# Altium project 2418driver.PrjPcb
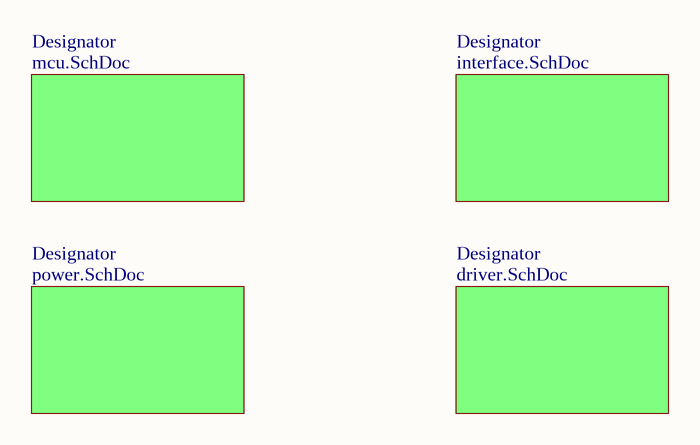
[diagram p0: 2418driver.SchDoc]
5 sheets, 136 parts. Net scope: global (net labels, ports and power ports of the same name join across sheets).
Board file: 2418driver.PcbDoc
Sheets:
  2418driver.SchDoc
    Designator = mcu.SchDoc
    Designator = interface.SchDoc
    Designator = power.SchDoc
    Designator = driver.SchDoc

## Sheet 2418driver.SchDoc
size A4

### Sub-sheets
Designator = mcu.SchDoc: no entries
Designator = interface.SchDoc: no entries
Designator = power.SchDoc: no entries
Designator = driver.SchDoc: no entries

## Sheet mcu.SchDoc
size A4
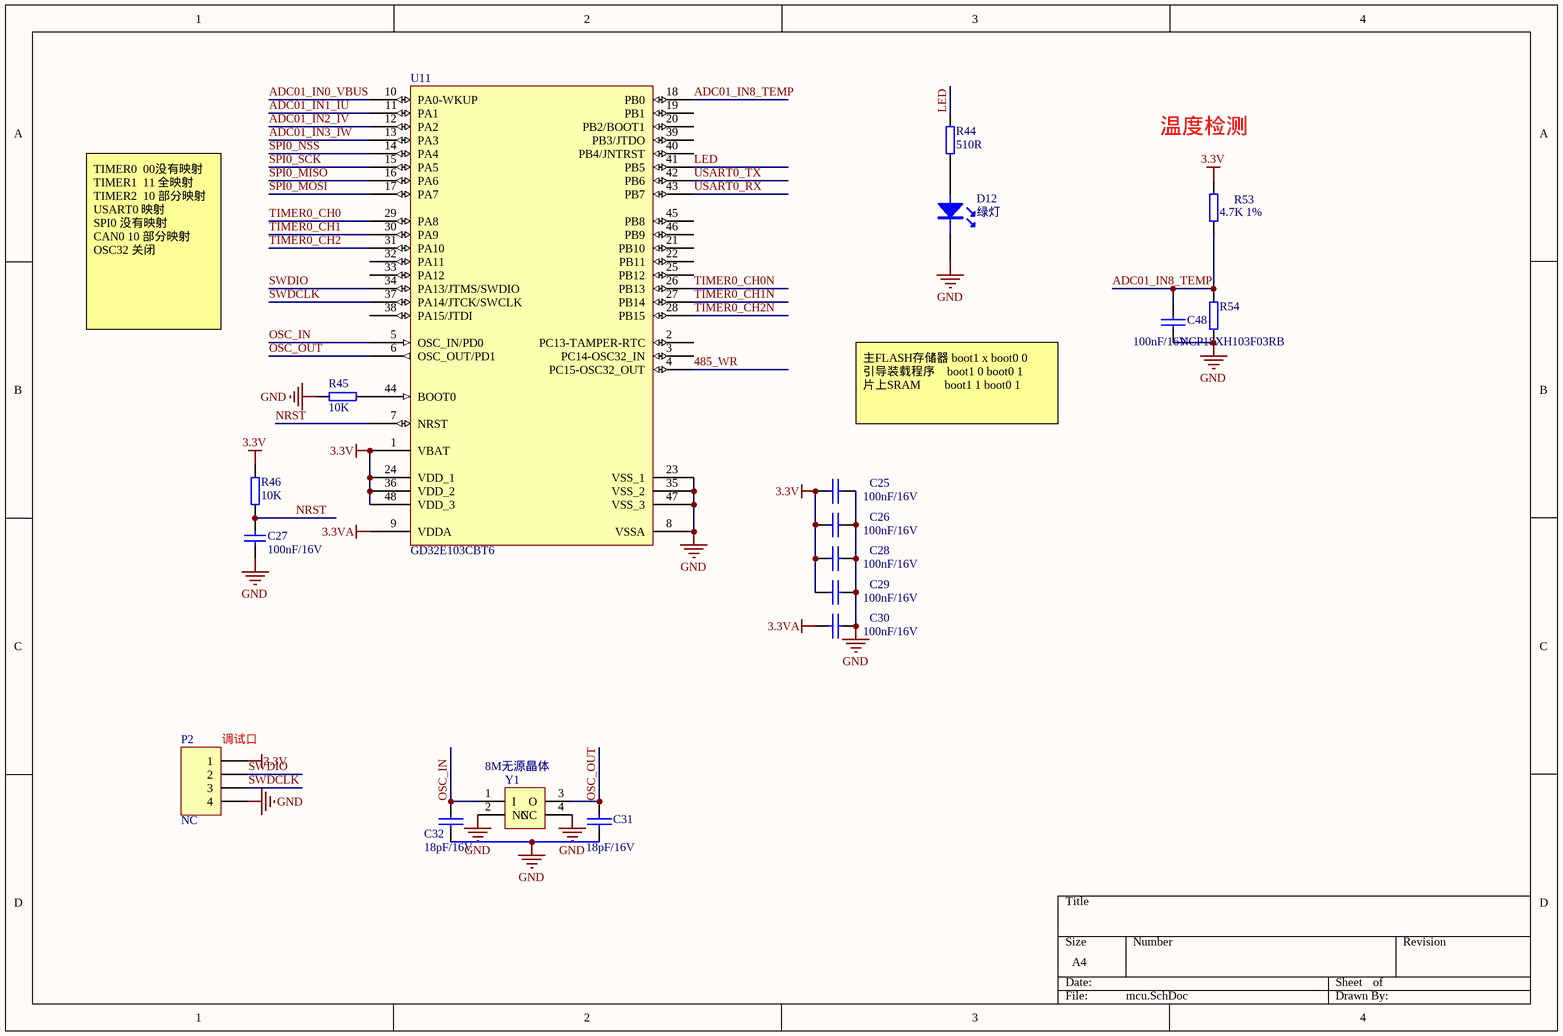
[diagram p1: mcu.SchDoc]

### Parts
C25  100nF/16V  [C0402]
C26  100nF/16V  [C0402]
C27  100nF/16V  [C0402]
C28  100nF/16V  [C0402]
C29  100nF/16V  [C0402]
C30  100nF/16V  [C0402]
C31  18pF/16V  [C0402]
C32  18pF/16V  [C0402]
C48  100nF/16V  [C0402]
D12  绿灯  [LED_0603]
P2  NC  [2.0*4]
R44  510R  [R0402]
R45  10K  [R0402]
R46  10K  [R0402]
R53  4.7K 1%  [R0402]
R54  NCP18XH103F03RB  [R0603]
U11  GD32E103CBT6  [LQFP-48]
Y1  8M无源晶体  [5032 4pin]

### Nets
3.3V: C25.2 C26.2 C28.2 C29.2 P2.1 R46.2 R53.2 U11.1(VBAT) U11.24(VDD_1) U11.36(VDD_2) U11.48(VDD_3)
3.3VA: C30.2 U11.9(VDDA)
GND: C25.1 C26.1 C27.1 C28.1 C29.1 C30.1 C31.1 C32.1 C48.2 D12.2(K) P2.4 R45.1 R54.1 U11.8(VSSA) U11.23(VSS_1) U11.35(VSS_2) U11.47(VSS_3) Y1.2(NC) Y1.4(NC)
485_WR: U11.4(PC15-OSC32_OUT)
ADC01_IN0_VBUS: U11.10(PA0-WKUP)
ADC01_IN1_IU: U11.11(PA1)
ADC01_IN2_IV: U11.12(PA2)
ADC01_IN3_IW: U11.13(PA3)
ADC01_IN8_TEMP: C48.1 R53.1 R54.2 U11.18(PB0)
LED: R44.1 U11.41(PB5)
NRST: C27.2 R46.1 U11.7(NRST)
OSC_IN: C32.2 U11.5(OSC_IN/PD0) Y1.1(I)
OSC_OUT: C31.2 U11.6(OSC_OUT/PD1) Y1.3(O)
SPI0_MISO: U11.16(PA6)
SPI0_MOSI: U11.17(PA7)
SPI0_NSS: U11.14(PA4)
SPI0_SCK: U11.15(PA5)
SWDCLK: P2.3 U11.37(PA14/JTCK/SWCLK)
SWDIO: P2.2 U11.34(PA13/JTMS/SWDIO)
TIMER0_CH0: U11.29(PA8)
TIMER0_CH0N: U11.26(PB13)
TIMER0_CH1: U11.30(PA9)
TIMER0_CH1N: U11.27(PB14)
TIMER0_CH2: U11.31(PA10)
TIMER0_CH2N: U11.28(PB15)
USART0_RX: U11.43(PB7)
USART0_TX: U11.42(PB6)
NetD12_1: D12.1(A) R44.2
NetR45_2: R45.2 U11.44(BOOT0)

Not connected (* = marked no-connect by the designer): U11 2(PC13-TAMPER-RTC) 3(PC14-OSC32_IN) 19(PB1) 20(PB2/BOOT1) 21(PB10) 22(PB11) 25(PB12) 32(PA11) 33(PA12) 38(PA15/JTDI) 39(PB3/JTDO) 40(PB4/JNTRST) 45(PB8) 46(PB9)

### Notes on the sheet
- 温度检测
- TIMER0  00没有映射
  TIMER1  11 全映射
  TIMER2  10 部分映射
  USART0 映射
  SPI0 没有映射
  CAN0 10 部分映射
  OSC32 关闭
- 主FLASH存储器 boot1 x boot0 0
  引导装载程序    boot1 0 boot0 1
  片上SRAM        boot1 1 boot0 1
- (near P2) 调试口

### Library data of the parts
C25 C26 C28-C32 C48 = CAP: Capacitor
C27 = cap
D12 = LED: 绿灯led
P2 = 排针2mm,1*4: 空，无器件; LatestRevisionDate: 17-Jul-2002; LatestRevisionNote: Re-released for DXP Platform.; Publisher: Altium Limited
R44 R53 R54 = R
R45 R46 = Resistance
U11 = GD32E103CxT6: Published: *; DatasheetVersion: *; PackageVersion: *; PackageReference: *; Publisher: *; PackageDescription: *; ComponentLink1Description: *; ComponentLink1URL: *; ComponentLink2Description: *; ComponentLink2URL: *
Y1 = OSC24

## Sheet interface.SchDoc
size A4
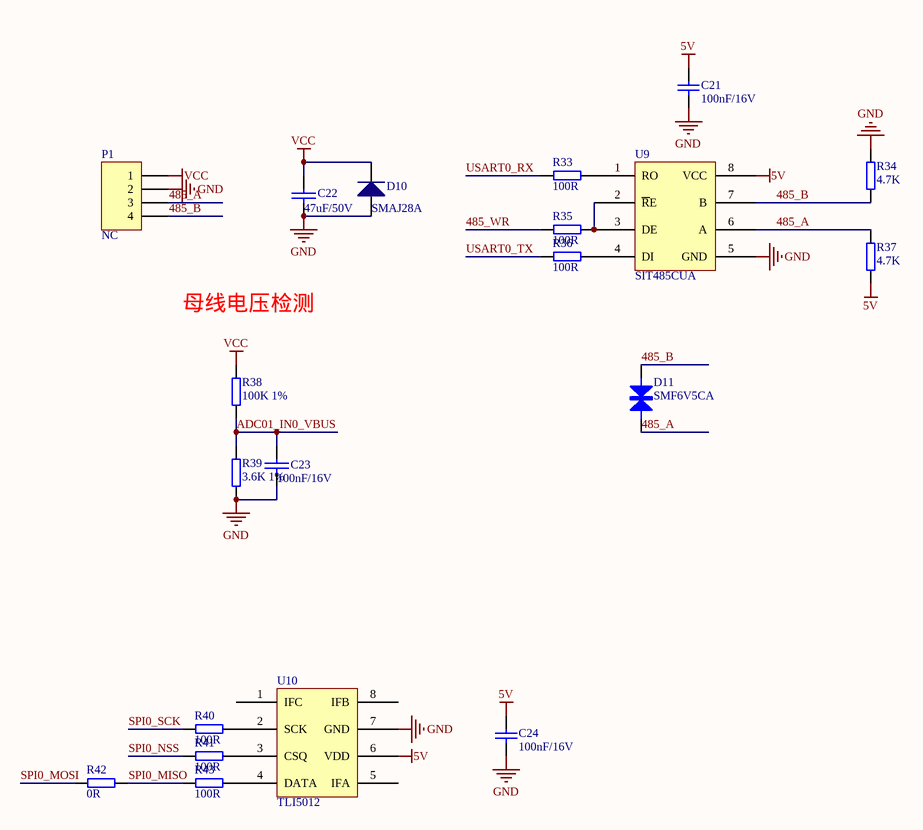
[diagram p2: interface.SchDoc]

### Parts
C21  100nF/16V  [C0402]
C22  47uF/50V  [C1210_N]
C23  100nF/16V  [C0402]
C24  100nF/16V  [C0402]
D10  SMAJ28A  [DO-214AC SMA]
D11  SMF6V5CA  [SOD-123]
P1  NC  [2.54-4]
R33  100R  [R0402]
R34  4.7K  [R0402]
R35  100R  [R0402]
R36  100R  [R0402]
R37  4.7K  [R0402]
R38  100K 1%  [R0402]
R39  3.6K 1%  [R0402]
R40  100R  [R0402]
R41  100R  [R0402]
R42  0R  [R0402]
R43  100R  [R0402]
U9  SIT485CUA  [VSSOP/MSOP-8]
U10  TLI5012  [SOIC-8]

### Nets
5V: C21.1 C24.1 R37.1 U9.8(VCC) U10.6(VDD)
GND: C21.2 C22.2 C23.2 C24.2 D10.1 P1.2 R34.2 R39.1 U9.5(GND) U10.7(GND)
VCC: C22.1 D10.2 P1.1 R38.2
485_A: D11.2(Anode) P1.3 R37.2 U9.6(A)
485_B: D11.1(Anode) P1.4 R34.1 U9.7(B)
485_WR: R35.2
ADC01_IN0_VBUS: C23.1 R38.1 R39.2
SPI0_MISO: R42.1 R43.2
SPI0_MOSI: R42.2
SPI0_NSS: R41.2
SPI0_SCK: R40.2
USART0_RX: R33.2
USART0_TX: R36.2
NetR33_1: R33.1 U9.1(RO)
NetR35_1: R35.1 U9.2(~{R}E) U9.3(DE)
NetR36_1: R36.1 U9.4(DI)
NetR40_1: R40.1 U10.2(SCK)
NetR41_1: R41.1 U10.3(CSQ)
NetR43_1: R43.1 U10.4(DATA)

Not connected (* = marked no-connect by the designer): U10 1(IFC) 5(IFA) 8(IFB)

### Notes on the sheet
- 母线电压检测

### Library data of the parts
C21 C24 = cap
C22 C23 = CAP: Capacitor
D10 = Diode
D11 = Bi-DIODES
P1 = Header 4: LatestRevisionDate: 17-Jul-2002; LatestRevisionNote: Re-released for DXP Platform.; Publisher: Altium Limited
R33-R43 = Resistance
U9 = SP485
U10 = TLE5012

## Sheet power.SchDoc
size A4
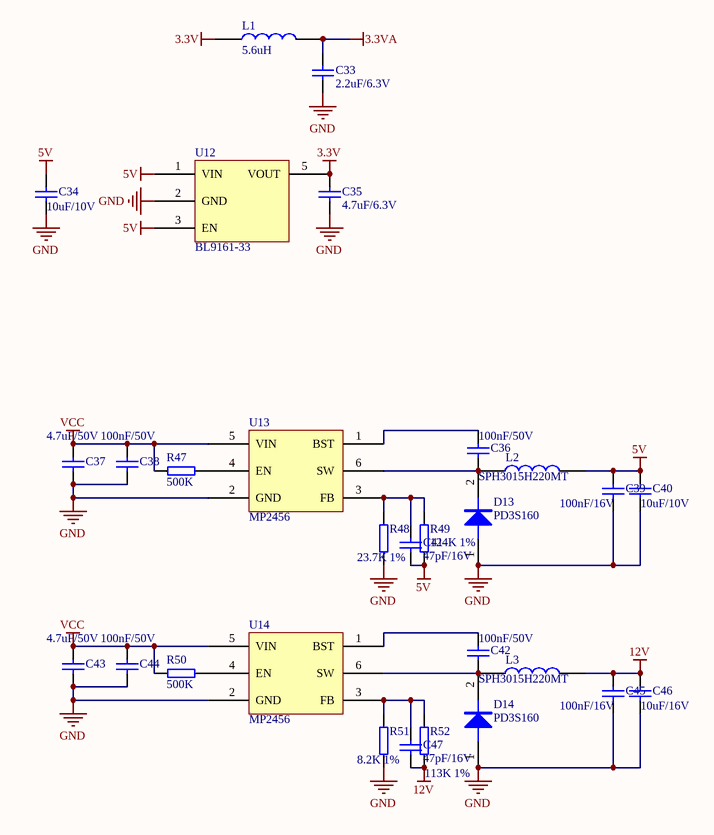
[diagram p3: power.SchDoc]

### Parts
C33  2.2uF/6.3V  [C0402]
C34  10uF/10V  [C0603]
C35  4.7uF/6.3V  [C0603]
C36  100nF/50V  [C0402]
C37  4.7uF/50V  [C0603]
C38  100nF/50V  [C0402]
C39  100nF/16V  [C0402]
C40  10uF/10V  [C0603]
C41  47pF/16V  [C0402]
C42  100nF/50V  [C0402]
C43  4.7uF/50V  [C0603]
C44  100nF/50V  [C0402]
C45  100nF/16V  [C0402]
C46  10uF/16V  [C0805]
C47  47pF/16V  [C0402]
D13  PD3S160  [POWERDI323]
D14  PD3S160  [POWERDI323]
L1  5.6uH  [L0402]
L2  SPH3015H220MT  [SPH3015]
L3  SPH3015H220MT  [SPH3015]
R47  500K  [R0402]
R48  23.7K 1%  [R0402]
R49  124K 1%  [R0402]
R50  500K  [R0402]
R51  8.2K 1%  [R0402]
R52  113K 1%  [R0402]
U12  BL9161-33  [SOT-23(5)]
U13  MP2456  [SOT-23(6)]
U14  MP2456  [SOT-23(6)]

### Nets
3.3V: C35.2 L1.1 U12.5(VOUT)
3.3VA: C33.2 L1.2
5V: C34.2 C39.2 C40.2 C41.2 L2.2 R49.1 U12.1(VIN) U12.3(EN)
12V: C45.2 C46.2 C47.2 L3.2 R52.1
GND: C33.1 C34.1 C35.1 C37.1 C38.1 C39.1 C40.1 C43.1 C44.1 C45.1 C46.1 D13.1(A) D14.1(A) R48.1 R51.1 U12.2(GND) U13.2(GND) U14.2(GND)
VCC: C37.2 C38.2 C43.2 C44.2 R47.1 R50.1 U13.5(VIN) U14.5(VIN)
NetC36_1: C36.1 U13.1(BST)
NetC36_2: C36.2 D13.2(K) L2.1 U13.6(SW)
NetC41_1: C41.1 R48.2 R49.2 U13.3(FB)
NetC42_1: C42.1 U14.1(BST)
NetC42_2: C42.2 D14.2(K) L3.1 U14.6(SW)
NetC47_1: C47.1 R51.2 R52.2 U14.3(FB)
NetR47_2: R47.2 U13.4(EN)
NetR50_2: R50.2 U14.4(EN)

### Library data of the parts
C33-C47 = cap
D13 D14 = DIODE
L1 = INDUCTOR: 贴片电感
L2 L3 = INDUCTOR: 顺络 22uH
R47-R52 = Resistance
U12 = BL9161

## Sheet driver.SchDoc
size A4
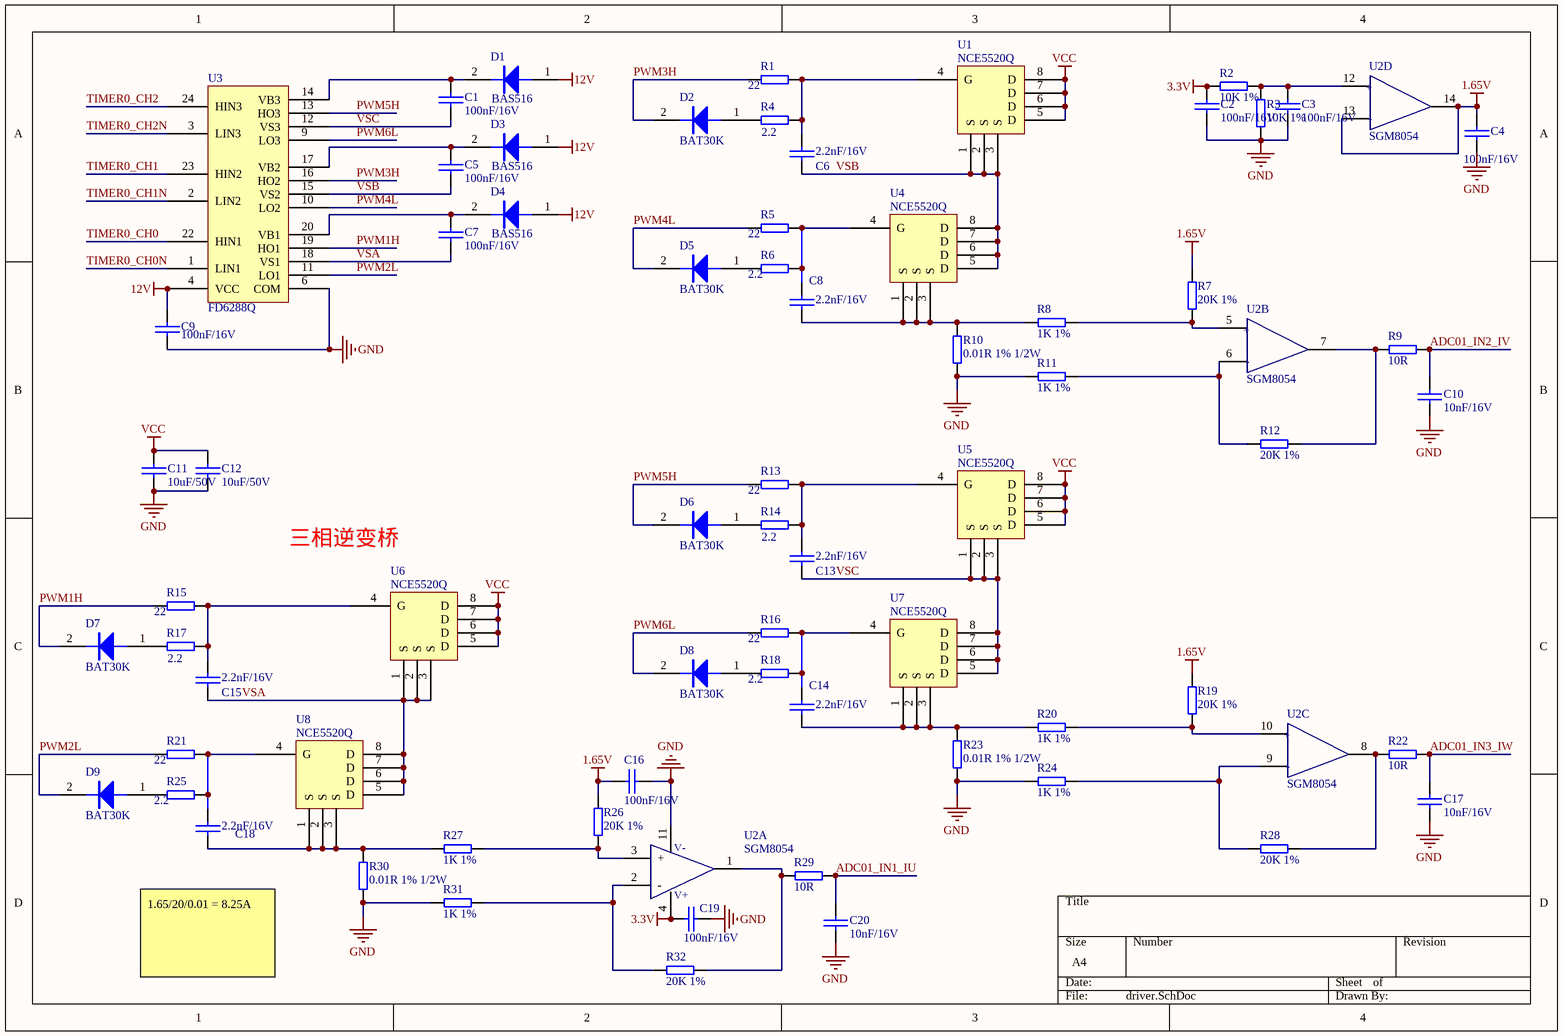
[diagram p4: driver.SchDoc]

### Parts
C1  100nF/16V  [C0402]
C2  100nF/16V  [C0402]
C3  100nF/16V  [C0402]
C4  100nF/16V  [C0402]
C5  100nF/16V  [C0402]
C6  2.2nF/16V  [C0402]
C7  100nF/16V  [C0402]
C8  2.2nF/16V  [C0402]
C9  100nF/16V  [C0402]
C10  10nF/16V  [C0402]
C11  10uF/50V  [C1206]
C12  10uF/50V  [C1206]
C13  2.2nF/16V  [C0402]
C14  2.2nF/16V  [C0402]
C15  2.2nF/16V  [C0402]
C16  100nF/16V  [C0402]
C17  10nF/16V  [C0402]
C18  2.2nF/16V  [C0402]
C19  100nF/16V  [C0402]
C20  10nF/16V  [C0402]
D1  BAS516  [SOD-523/SC-79]
D2  BAT30K  [SOD-523/SC-79]
D3  BAS516  [SOD-523/SC-79]
D4  BAS516  [SOD-523/SC-79]
D5  BAT30K  [SOD-523/SC-79]
D6  BAT30K  [SOD-523/SC-79]
D7  BAT30K  [SOD-523/SC-79]
D8  BAT30K  [SOD-523/SC-79]
D9  BAT30K  [SOD-523/SC-79]
R1  22  [R0402]
R2  10K 1%  [R0402]
R3  10K 1%  [R0402]
R4  2.2  [R0402]
R5  22  [R0402]
R6  2.2  [R0402]
R7  20K 1%  [R0402]
R8  1K 1%  [R0402]
R9  10R  [R0402]
R10  0.01R 1% 1/2W  [R0805]
R11  1K 1%  [R0402]
R12  20K 1%  [R0402]
R13  22  [R0402]
R14  2.2  [R0402]
R15  22  [R0402]
R16  22  [R0402]
R17  2.2  [R0402]
R18  2.2  [R0402]
R19  20K 1%  [R0402]
R20  1K 1%  [R0402]
R21  22  [R0402]
R22  10R  [R0402]
R23  0.01R 1% 1/2W  [R0805]
R24  1K 1%  [R0402]
R25  2.2  [R0402]
R26  20K 1%  [R0402]
R27  1K 1%  [R0402]
R28  20K 1%  [R0402]
R29  10R  [R0402]
R30  0.01R 1% 1/2W  [R0805]
R31  1K 1%  [R0402]
R32  20K 1%  [R0402]
U1  NCE5520Q  [DFN3X3-8L]
U2  SGM8054  [TSSOP-14]  (parts A,B,C,D of 4)
U3  FD6288Q  [QFN_P0.5_24]
U4  NCE5520Q  [DFN3X3-8L]
U5  NCE5520Q  [DFN3X3-8L]
U6  NCE5520Q  [DFN3X3-8L]
U7  NCE5520Q  [DFN3X3-8L]
U8  NCE5520Q  [DFN3X3-8L]

### Nets
1.65V: C4.1 C16.2 R7.1 R19.1 R26.1 U2.13(-) U2.14(OUT2)
3.3V: C2.1 C19.2 R2.1 U2.4(V+)
12V: C9.2 D1.1(A) D3.1(A) D4.1(A) U3.4(VCC)
GND: C2.2 C3.2 C4.2 C9.1 C10.2 C11.2 C12.2 C16.1 C17.2 C19.1 C20.2 R3.2 R10.2 R11.2 R23.2 R24.2 R30.2 R31.2 U2.11(V-) U3.6(COM)
VCC: C11.1 C12.1 U1.5(D) U1.6(D) U1.7(D) U1.8(D) U5.5(D) U5.6(D) U5.7(D) U5.8(D) U6.5(D) U6.6(D) U6.7(D) U6.8(D)
ADC01_IN1_IU: C20.1 R29.1
ADC01_IN2_IV: C10.1 R9.1
ADC01_IN3_IW: C17.1 R22.1
PWM1H: D7.2(K) R15.2 U3.19(HO1)
PWM2L: D9.2(K) R21.2 U3.11(LO1)
PWM3H: D2.2(K) R1.2 U3.16(HO2)
PWM4L: D5.2(K) R5.2 U3.10(LO2)
PWM5H: D6.2(K) R13.2 U3.13(HO3)
PWM6L: D8.2(K) R16.2 U3.9(LO3)
TIMER0_CH0: U3.22(HIN1)
TIMER0_CH0N: U3.1(LIN1)
TIMER0_CH1: U3.23(HIN2)
TIMER0_CH1N: U3.2(LIN2)
TIMER0_CH2: U3.24(HIN3)
TIMER0_CH2N: U3.3(LIN3)
VSA: C7.1 C15.2 U3.18(VS1) U6.1(S) U6.2(S) U6.3(S) U8.5(D) U8.6(D) U8.7(D) U8.8(D)
VSB: C5.1 C6.2 U1.1(S) U1.2(S) U1.3(S) U3.15(VS2) U4.5(D) U4.6(D) U4.7(D) U4.8(D)
VSC: C1.1 C13.2 U3.12(VS3) U5.1(S) U5.2(S) U5.3(S) U7.5(D) U7.6(D) U7.7(D) U7.8(D)
NetC1_2: C1.2 D1.2(K) U3.14(VB3)
NetC3_1: C3.1 R2.2 R3.1 U2.12(+)
NetC5_2: C5.2 D3.2(K) U3.17(VB2)
NetC6_1: C6.1 R1.1 R4.2 U1.4(G)
NetC7_2: C7.2 D4.2(K) U3.20(VB1)
NetC8_1: C8.1 R5.1 R6.2 U4.4(G)
NetC8_2: C8.2 R8.2 R10.1 U4.1(S) U4.2(S) U4.3(S)
NetC13_1: C13.1 R13.1 R14.2 U5.4(G)
NetC14_1: C14.1 R16.1 R18.2 U7.4(G)
NetC14_2: C14.2 R20.2 R23.1 U7.1(S) U7.2(S) U7.3(S)
NetC15_1: C15.1 R15.1 R17.2 U6.4(G)
NetC18_1: C18.1 R21.1 R25.2 U8.4(G)
NetC18_2: C18.2 R27.2 R30.1 U8.1(S) U8.2(S) U8.3(S)
NetD2_1: D2.1(A) R4.1
NetD5_1: D5.1(A) R6.1
NetD6_1: D6.1(A) R14.1
NetD7_1: D7.1(A) R17.1
NetD8_1: D8.1(A) R18.1
NetD9_1: D9.1(A) R25.1
NetR7_2: R7.2 R8.1 U2.5(+)
NetR9_2: R9.2 R12.1 U2.7(OUT2)
NetR11_1: R11.1 R12.2 U2.6(-)
NetR19_2: R19.2 R20.1 U2.10(+)
NetR22_2: R22.2 R28.1 U2.8(OUT2)
NetR24_1: R24.1 R28.2 U2.9(-)
NetR26_2: R26.2 R27.1 U2.3(+)
NetR29_2: R29.2 R32.1 U2.1(OUT1)
NetR31_1: R31.1 R32.2 U2.2(-)

### Notes on the sheet
- 三相逆变桥
- 1.65/20/0.01 = 8.25A

### Library data of the parts
C1-C20 = CAP: Capacitor
D1-D9 = DIODE
R1 R4-R6 R13-R18 R21 R25 = R
R2 R3 R7-R12 R19 R20 R22-R24 R26-R32 = Resistance
U1 U4-U8 = SI7465DP
U3 = FD6288Q: 峰岹科技

## Nets that join several sheets
3.3V: mcu (11 pins), power (C35.2 L1.1 U12.5), driver (C2.1 C19.2 R2.1 U2.4)
3.3VA: mcu (C30.2 U11.9), power (C33.2 L1.2)
5V: interface (5 pins), power (8 pins)
12V: power (5 pins), driver (5 pins)
GND: mcu (19 pins), interface (10 pins), power (18 pins), driver (20 pins)
VCC: interface (C22.1 D10.2 P1.1 R38.2), power (8 pins), driver (14 pins)
485_WR: mcu (U11.4), interface (R35.2)
ADC01_IN0_VBUS: mcu (U11.10), interface (C23.1 R38.1 R39.2)
ADC01_IN1_IU: mcu (U11.11), driver (C20.1 R29.1)
ADC01_IN2_IV: mcu (U11.12), driver (C10.1 R9.1)
ADC01_IN3_IW: mcu (U11.13), driver (C17.1 R22.1)
SPI0_MISO: mcu (U11.16), interface (R42.1 R43.2)
SPI0_MOSI: mcu (U11.17), interface (R42.2)
SPI0_NSS: mcu (U11.14), interface (R41.2)
SPI0_SCK: mcu (U11.15), interface (R40.2)
TIMER0_CH0: mcu (U11.29), driver (U3.22)
TIMER0_CH0N: mcu (U11.26), driver (U3.1)
TIMER0_CH1: mcu (U11.30), driver (U3.23)
TIMER0_CH1N: mcu (U11.27), driver (U3.2)
TIMER0_CH2: mcu (U11.31), driver (U3.24)
TIMER0_CH2N: mcu (U11.28), driver (U3.3)
USART0_RX: mcu (U11.43), interface (R33.2)
USART0_TX: mcu (U11.42), interface (R36.2)